# Altium schematic sheet 电源.SchDoc
size A4
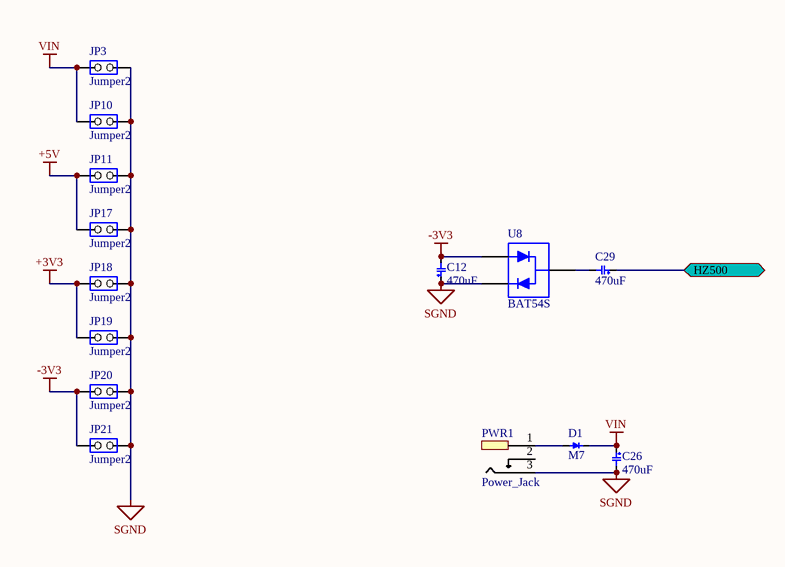
[diagram p0: 电源.SchDoc]

## Parts
C12  470uF  [电容卧P2.54-D6.3-H7]
C26  470uF  [电容卧P3.5-D8-H11.5]
C29  470uF  [电容卧P2.54-D6.3-H7]
D1  M7  [SMA]
JP3  Jumper2  [CON2-P2.54]
JP10  Jumper2  [CON2-P2.54]
JP11  Jumper2  [CON2-P2.54]
JP17  Jumper2  [CON2-P2.54]
JP18  Jumper2  [CON2-P2.54]
JP19  Jumper2  [CON2-P2.54]
JP20  Jumper2  [CON2-P2.54]
JP21  Jumper2  [CON2-P2.54]
PWR1  Power_Jack  [Jack 2.1]
U8  BAT54S  [SOT-23-3L]

## Ports
HZ500

## Nets
+3V3: JP18.1(COMMON) JP19.1(COMMON)
+5V: JP11.1(COMMON) JP17.1(COMMON)
-3V3: C12.2 JP20.1(COMMON) JP21.1(COMMON) U8.1
SGND: C12.1 C26.2 JP3.2(NO) JP10.2(NO) JP11.2(NO) JP17.2(NO) JP18.2(NO) JP19.2(NO) JP20.2(NO) JP21.2(NO) PWR1.3 U8.2
VIN: C26.1 D1.1 JP3.1(COMMON) JP10.1(COMMON)
HZ500: C29.1 ; port HZ500
NetC29_2: C29.2 U8.3
NetD1_2: D1.2 PWR1.1

Not connected (* = marked no-connect by the designer): PWR1 2

## Library data of the parts
C12 C29 = Cap Pol: 极性电容; specifications: 6.3V,±20%; Published: 8-Jun-2000; LatestRevisionDate: 17-Jul-2002; LatestRevisionNote: Re-released for DXP Platform.; PackageReference: RB7.6-15; Publisher: Altium Limited; Value: 470uF
C26 = Cap Pol: 极性电容; specifications: 25V,±20%; Published: 8-Jun-2000; LatestRevisionDate: 17-Jul-2002; LatestRevisionNote: Re-released for DXP Platform.; PackageReference: RB7.6-15; Publisher: Altium Limited; Value: 470uF
D1 = Diode: 二极管; Published: 8-Jun-2000; LatestRevisionDate: 17-Jul-2002; LatestRevisionNote: Re-released for DXP Platform.; PackageVersion: Sep-1996; PackageReference: SMC; Publisher: Altium Limited; Code_JEDEC: DO-214-AB; value: M7
PWR1 = Power_Jack: DC Power Jack; Manufacturer: Switchcraft; Idc: 5A; OrderingCode: RAPC722X; OrderingCode 2: PJ-002A; Part Number: DC Power Jack; Price (€): 0,552; Manufacturer 2: CUI Inc
U8 = diode BAT54S